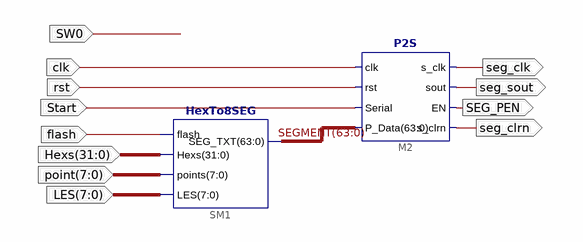
[diagram p0: schematic sheet 1]
// Xilinx ISE schematic SSeg7_Dev.sch (kintex7) as structural Verilog: 2 symbols, 12 ports
module SSeg7_Dev (
  input  SW0,
  input  [31:0] Hexs,
  input  [7:0] point,
  input  [7:0] LES,
  input  flash,
  input  clk,
  input  rst,
  input  Start,
  output seg_clk,
  output seg_sout,
  output SEG_PEN,
  output seg_clrn
);

  wire [63:0] SEGMENT;

  HexTo8SEG SM1 (.LES(LES), .points(point), .Hexs(Hexs), .SEG_TXT(SEGMENT), .flash(flash));
  P2S M2 (
    .s_clrn(seg_clrn), .sout(seg_sout), .rst(rst), .EN(SEG_PEN), .Serial(Start), .clk(clk), .s_clk(seg_clk),
    .P_Data(SEGMENT));
endmodule
